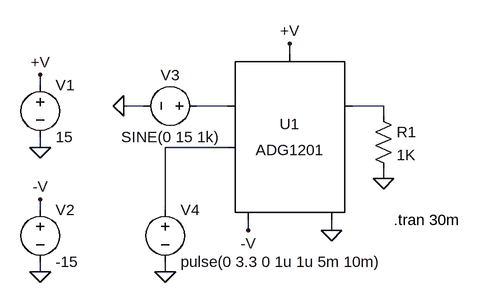
[diagram p0: schematic ADG1201.asc]
ADG1201.asc, the LTspice schematic file:
Version 4
SHEET 1 2844 1336
WIRE -144 -80 -144 -96
WIRE -528 -32 -528 -48
WIRE -368 0 -400 0
WIRE -240 0 -288 0
WIRE 0 0 -48 0
WIRE 0 16 0 0
WIRE -528 64 -528 48
WIRE -240 64 -336 64
WIRE 0 112 0 96
WIRE -528 160 -528 144
WIRE -336 160 -336 64
WIRE -208 192 -208 176
WIRE -80 192 -80 176
WIRE -528 256 -528 240
WIRE -336 256 -336 240
FLAG -528 256 0
FLAG -528 64 0
FLAG -528 -48 +V
FLAG -528 144 -V
FLAG -400 0 0
FLAG -208 192 -V
FLAG -144 -96 +V
FLAG -80 192 0
FLAG -336 256 0
FLAG 0 112 0
SYMBOL voltage -528 -48 R0
WINDOW 123 0 0 Left 0
WINDOW 39 0 0 Left 0
SYMATTR InstName V1
SYMATTR Value 15
SYMBOL voltage -528 144 R0
WINDOW 123 0 0 Left 0
WINDOW 39 0 0 Left 0
SYMATTR InstName V2
SYMATTR Value -15
SYMBOL voltage -272 0 M270
WINDOW 0 32 56 VTop 2
WINDOW 3 -32 56 VBottom 2
WINDOW 123 0 0 Left 0
WINDOW 39 0 0 Left 0
SYMATTR InstName V3
SYMATTR Value SINE(0 15 1k)
SYMBOL voltage -336 144 R0
SYMATTR InstName V4
SYMATTR Value pulse(0 3.3 0 1u 1u 5m 10m)
SYMBOL res -16 0 R0
SYMATTR InstName R1
SYMATTR Value 1K
SYMBOL ADG1201 -144 48 R0
SYMATTR InstName U1
TEXT 16 176 Left 2 !.tran 30m

The netlist it stands for:
* ADG1201.asc
V1 +V 0 15
V2 -V 0 -15
V3 N001 0 SINE(0 15 1k)
V4 N003 0 pulse(0 3.3 0 1u 1u 5m 10m)
R1 N002 0 1K
XU1 N003 N002 N001 -V 0 +V ADG1201
.tran 30m
.lib ADG1201.sub
.backanno
.end